# Altium schematic sheet MAIN.SchDoc
size A4; SheetNumber: 1; SheetTotal: 4
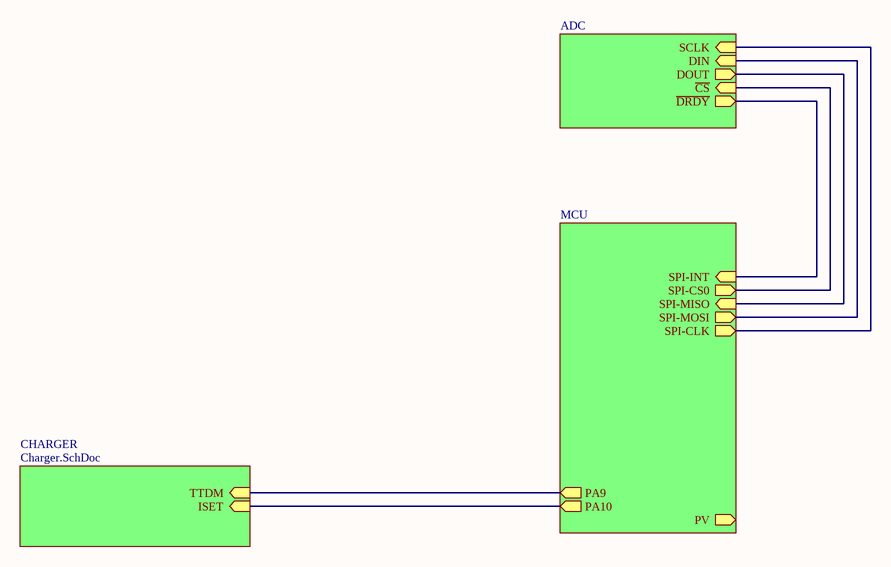
[diagram p0: MAIN.SchDoc]

## Sub-sheets
ADC = ThermoE.SchDoc: SCLK (in), DIN (in), ~{CS} (in), DOUT (out), ~{DRDY} (out)
CHARGER = Charger.SchDoc: TTDM (in), ISET (in)
MCU = STM32F030C8T6.SchDoc: SPI-MOSI (out), SPI-CS0 (out), SPI-MISO (in), SPI-CLK (out), SPI-INT (in), PV (out), PA9 (out), PA10 (out)

## Nets
(unnamed): sheet ADC/SCLK, sheet MCU/SPI-CLK
(unnamed): sheet ADC/DIN, sheet MCU/SPI-MOSI
(unnamed): sheet ADC/~{CS}, sheet MCU/SPI-CS0
(unnamed): sheet ADC/DOUT, sheet MCU/SPI-MISO
(unnamed): sheet ADC/~{DRDY}, sheet MCU/SPI-INT
(unnamed): sheet MCU/PA9, sheet CHARGER/TTDM
(unnamed): sheet MCU/PA10, sheet CHARGER/ISET